# EAGLE design Hub (EAGLE 7.1.0)
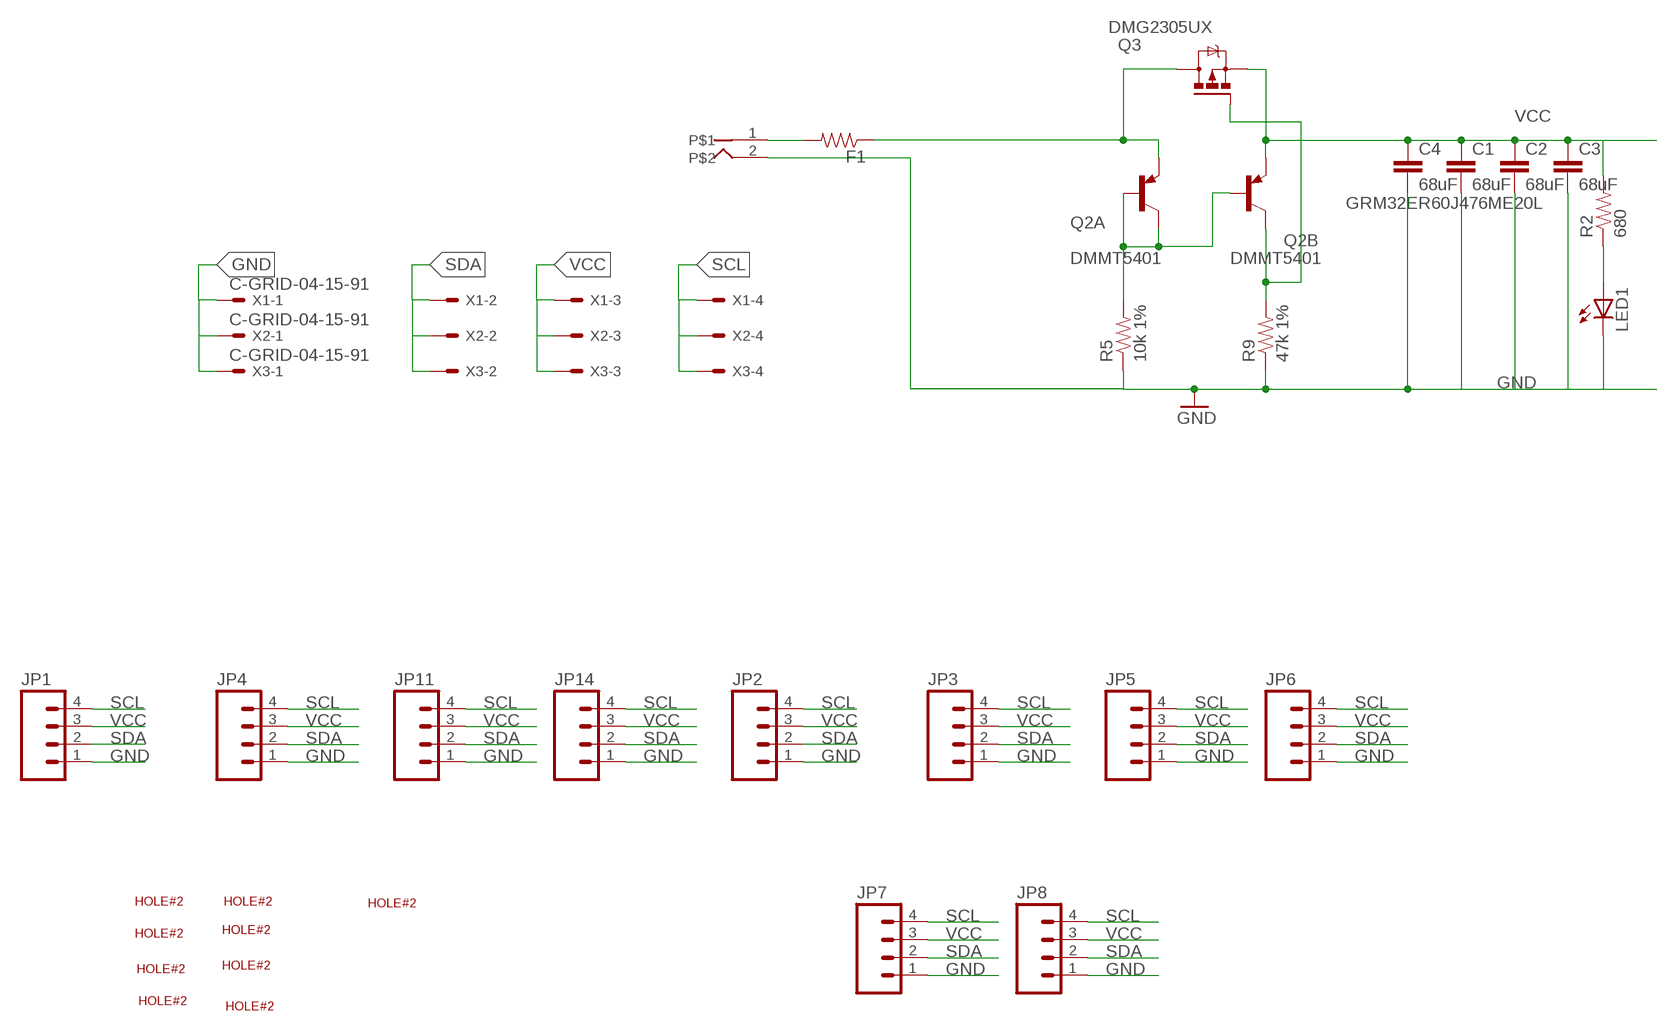
[diagram p0: schematic, sheet 1]

## Parts
C1  68uF  CAP1210  [1210]
C2  68uF  CAP1210  [1210]
C3  68uF  CAP1210  [1210]
C4  68uF  CAP1210  [1210]
F1  RESISTOR0805-RES  [0805]
JP1  M04LOCK  [1X04_LOCK]
JP2  M04LOCK  [1X04_LOCK]
JP3  M04LOCK  [1X04_LOCK]
JP4  M04LOCK  [1X04_LOCK]
JP5  M04LOCK  [1X04_LOCK]
JP6  M04LOCK  [1X04_LOCK]
JP7  M04LOCK  [1X04_LOCK]
JP8  M04LOCK  [1X04_LOCK]
JP11  M04LOCK  [1X04_LOCK]
JP14  M04LOCK  [1X04_LOCK]
LED1  LEDCHIP-LED0805  [CHIP-LED0805]
Q2  DMMT5401  TRANSISTOR-DUAL-PNP  [SOT-26]
Q3  DMG2305UX  IRLML5203  [MICRO3]
R2  680  RESISTOR0805-RES  [0805]
R5  10k 1%  RESISTOR0805-RES  [0805]
R9  47k 1%  RESISTOR0805-RES  [0805]
U$1  DC-JACKLOWPRO  [DC-POWER-JACK-LOWPRO]
U$6  HOLE#2  [HOLE-#2]
U$7  HOLE#2  [HOLE-#2]
U$8  HOLE#2  [HOLE-#2]
U$9  HOLE#2  [HOLE-#2]
U$10  HOLE#2  [HOLE-#2]
U$11  HOLE#2  [HOLE-#2]
U$12  HOLE#2  [HOLE-#2]
U$13  HOLE#2  [HOLE-#2]
U$14  HOLE#2  [HOLE-#2]
X1  C-GRID-04-15-91  [15-91-04]
X2  C-GRID-04-15-91  [15-91-04]
X3  C-GRID-04-15-91  [15-91-04]

## Nets
GND: C1.2 C2.2 C3.2 C4.2 JP1.1 JP2.1 JP3.1 JP4.1 JP5.1 JP6.1 JP7.1 JP8.1 JP11.1 JP14.1 LED1.C R5.1 R9.1 U$1.2 X1.1 X2.1 X3.1
N$1: F1.2 U$1.1
N$8: LED1.A R2.1
N$14: Q2.1(A:C) Q2.2(A:B) Q2.3(B:B) R5.2
N$16: Q2.4(B:C) Q3.1(G) R9.2
SCL: JP1.4 JP2.4 JP3.4 JP4.4 JP5.4 JP6.4 JP7.4 JP8.4 JP11.4 JP14.4 X1.4 X2.4 X3.4
SDA: JP1.2 JP2.2 JP3.2 JP4.2 JP5.2 JP6.2 JP7.2 JP8.2 JP11.2 JP14.2 X1.2 X2.2 X3.2
VCC: C1.1 C2.1 C3.1 C4.1 JP1.3 JP2.3 JP3.3 JP4.3 JP5.3 JP6.3 JP7.3 JP8.3 JP11.3 JP14.3 Q2.5(B:E) Q3.2(S) R2.2 X1.3 X2.3 X3.3
VREG: F1.1 Q2.6(A:E) Q3.3(D)
Unconnected: U$6.P$1(HOLE) U$7.P$1(HOLE) U$8.P$1(HOLE) U$9.P$1(HOLE) U$10.P$1(HOLE) U$11.P$1(HOLE) U$12.P$1(HOLE) U$13.P$1(HOLE) U$14.P$1(HOLE)

## Notes on the sheet
- GRM32ER60J476ME20L

## Library data of the parts
C1-C4 = SparkFun-Capacitors:CAP: Capacitor Standard 0603 ceramic capacitor, and 0.1" leaded capacitor.
F1 R2 R5 R9 = SparkFun-Passives:RESISTOR: Resistor Basic schematic elements and footprints for 0603, 1206, and PTH resistors.
JP1-JP8 JP11 JP14 = SparkFun-Connectors:M04: Header 4 Standard 4-pin 0.1" header. Use with straight break away headers (SKU : PRT-00116), right angle break away headers (PRT-00553), swiss pins (PRT-00743), machine pins (PRT-00117), and female headers (PRT-00115). Molex polarized connector foot print use with SKU : PRT-08231 with associated crimp pins and housings. 1MM SMD Version SKU: PRT-10208
LED1 = adafruit:LED: LED OSRAM: - CHIPLED LG R971, LG N971, LY N971, LG Q971, LY Q971, LO R971, LY R971 LH N974, LH R974 LS Q976, LO Q976, LY Q976 LO Q996 - Hyper CHIPLED LW Q18S LB Q993, LB Q99A, LB R99A - SideLED LS A670, LO A670, LY A670, LG A670, LP A670 LB A673, LV A673, LT A673, LW A673 LH A674 LY A675 LS A676, LA A676, LO A676, LY A676, LW A676 LS A679, LY A679, LG A679 - Hyper Micro SIDELED® LS Y876, LA Y876, LO Y876, LY Y876 LT Y87S - SmartLED LW L88C, LW L88S LB L89C, LB L89S, LG L890 LS L89K, LO L89K, LY L89K LS L896, LA L896, LO L896, LY L896 - TOPLED LS T670, LO T670, LY T670, LG T670, LP T670 LSG T670, LSP T670, LSY T670, LOP T670, LYG T670 LG T671, LOG T671, LSG T671 LB T673, LV T673, LT T673, LW T673 LH T674 LS T676, LA T676, LO T676, LY T676, LB T676, LH T676, LSB T676, LW T676 LB T67C, LV T67C, LT T67C, LS T67K, LO T67K, LY T67K, LW E67C LS E67B, LA E67B, LO E67B, LY E67B, LB E67C, LV E67C, LT E67C LW T67C LS T679, LY T679, LG T679 LS T770, LO T770, LY T770, LG T770, LP T770 LB T773, LV T773, LT T773, LW T773 LH T774 LS E675, LA E675, LY E675, LS T675 LS T776, LA T776, LO T776, LY T776, LB T776 LHGB T686 LT T68C, LB T68C - Hyper Mini TOPLED® LB M676 - Mini TOPLED Santana® LG M470 LS M47K, LO M47K, LY M47K Source: http://www.osram.convergy.de/
Q2 = IntegerLabs:TRANSISTOR-DUAL-PNP: PNP Transistor
Q3 = transistor-power:IRLML5203: HEXFET P-Channel Power MOSFET
U$1 = IntegerLabs:DC-JACK
U$6-U$14 = IntegerLabs:HOLE
X1-X3 = con-molex:C-GRID-04: CONNECTOR wire to board 2.54 mm (0.100") pitch header; OC_FARNELL: unknown; OC_NEWARK: unknown

## Board
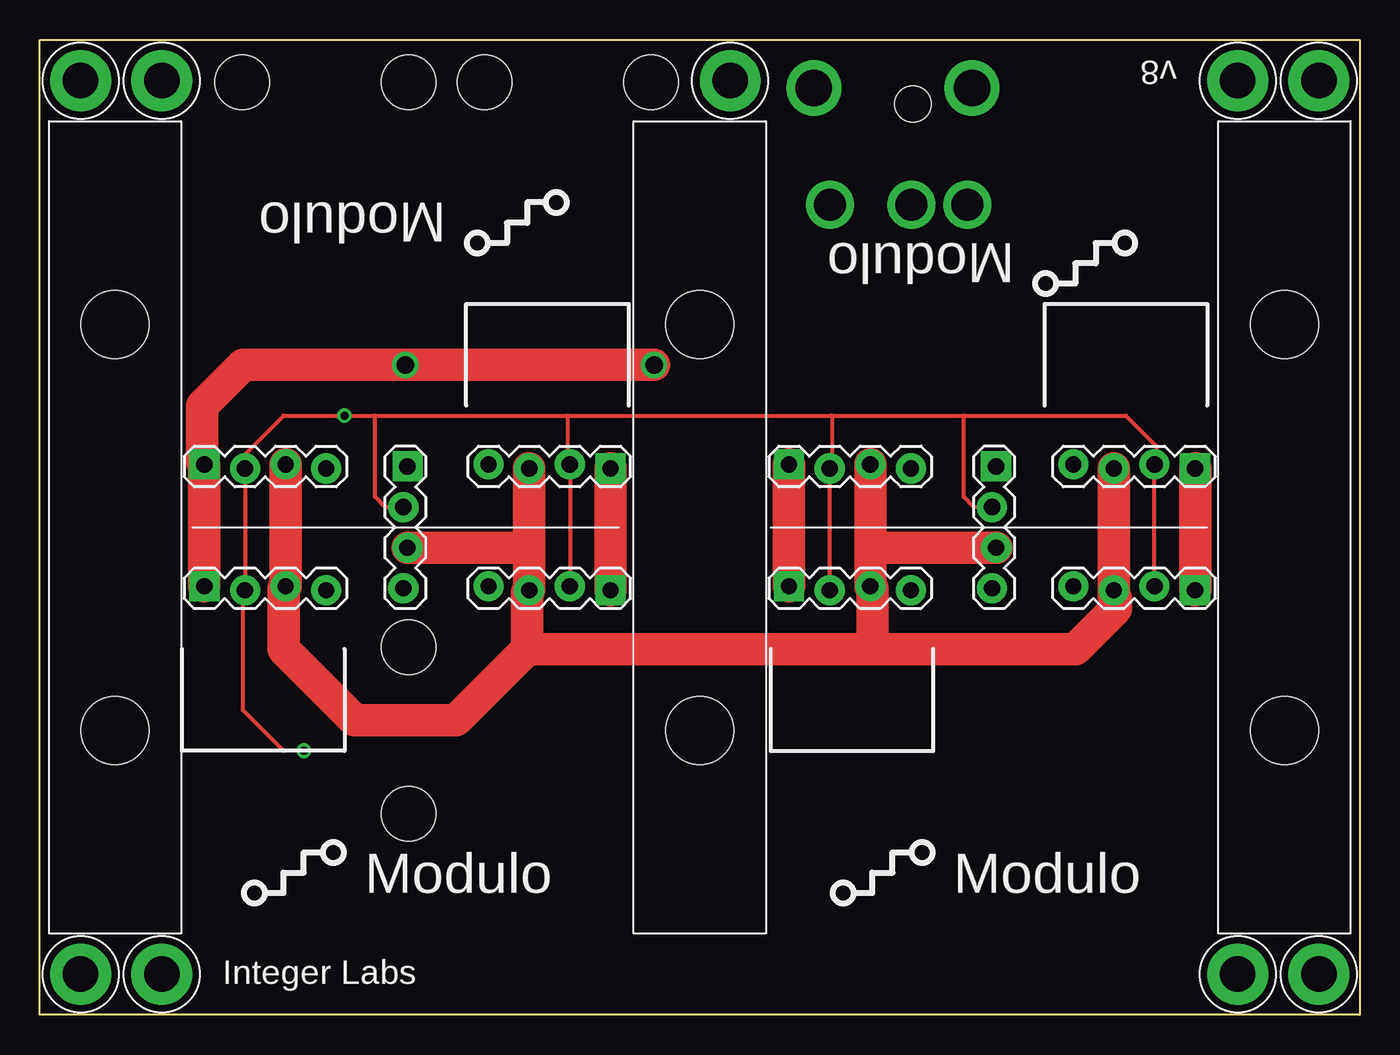
[diagram p1: board, top side]
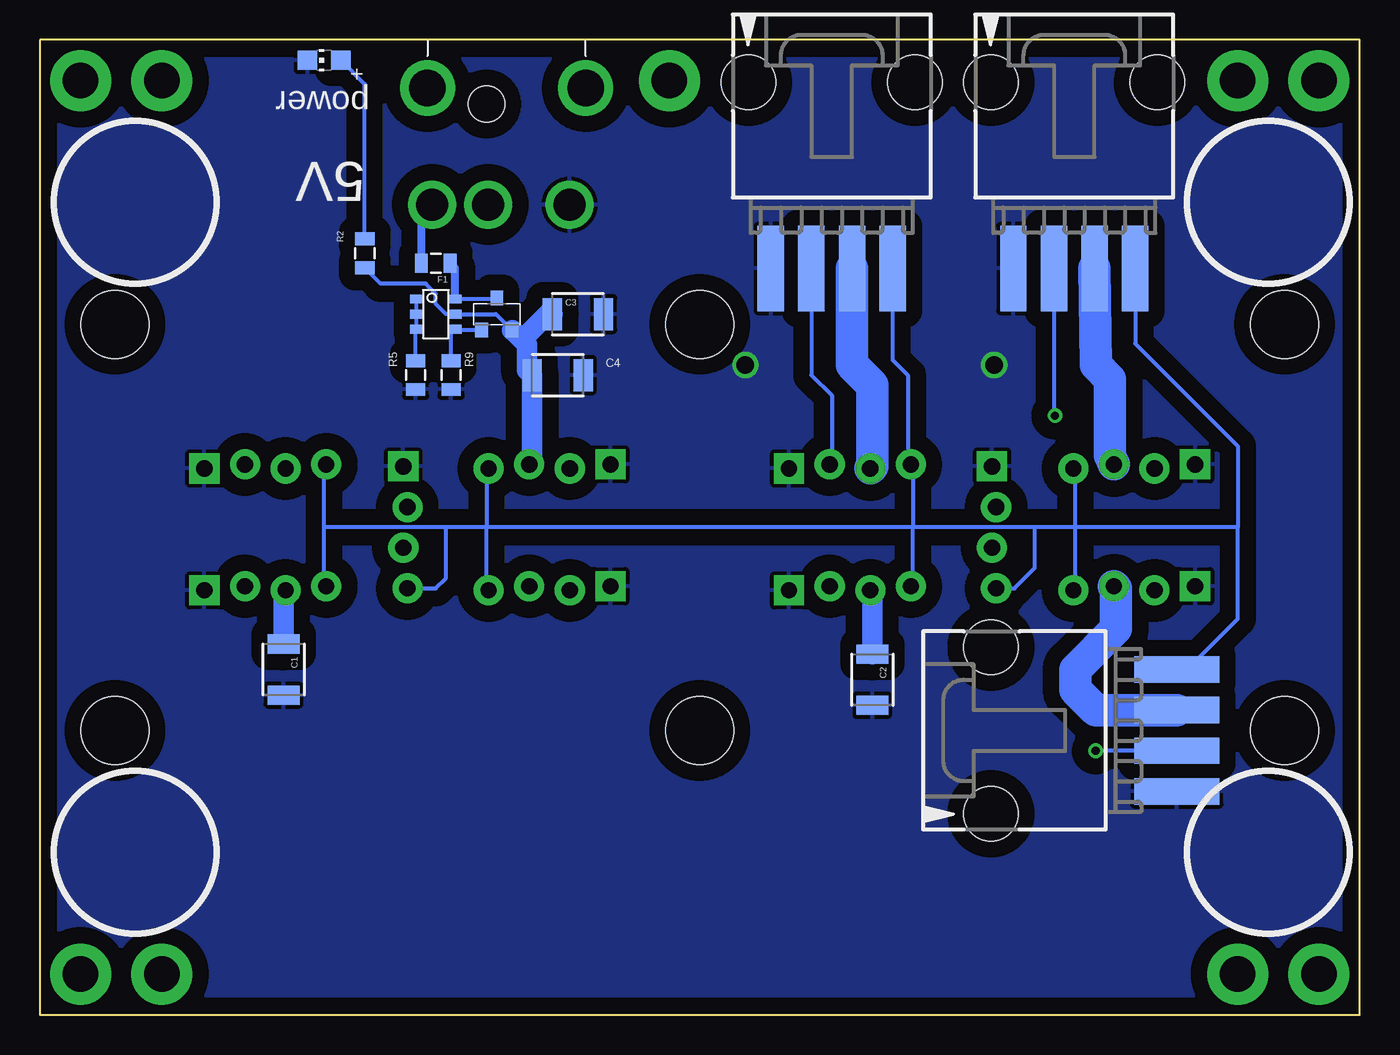
[diagram p2: board, bottom side, seen from below]

Size 82.55 x 60.96 mm. Coordinates in mm from the lower left corner, seen from the top.
Outline: 0,0 0,60.96 82.55,60.96 82.55,0 0,0
Copper layers (1*16): Top 0.0178mm / dielectric 59mil / Bottom 0.0178mm
Design rules "SSC-EAGLE-2Lyr_v1.0.0.3 *": minimum track width 6mil, minimum drill 14mil, track to track 6mil, track to pad 6mil, pad to pad 6mil, via to via 6mil, smd to smd 6mil, copper to edge 20mil, drill to drill 16mil, minimum pad ring 8mil, minimum via ring 8mil, stop-mask expansion 3mil, vias tented up to drill 25mil, thermal gap 10mil

### Footprints (pad centres in the part's own frame; a part is rotated, then mirrored left to right if it is on the bottom)
1210 = smd 1.2 x 2: 1 -1.6,0; 2 1.6,0
0805 = smd 0.8 x 1.2: 1 -0.9,0; 2 0.9,0
1X04_LOCK = drill 1.016 pad 1.88 square: 1 0,0.127 | drill 1.016 pad 1.88: 2 2.54,-0.127; 3 5.08,0.127; 4 7.62,-0.127
CHIP-LED0805 = smd 1.2 x 1.2: A 0,-1.05; C 0,1.05
SOT-26 = smd 0.55 x 0.8: 1 -0.95,-1.2; 2 0,-1.2; 3 0.95,-1.2; 4 0.95,1.2; 5 0,1.2; 6 -0.95,1.2
MICRO3 = smd 0.8 x 0.9: 1 -0.95,-1; 2 0.95,-1; 3 0,1
DC-POWER-JACK-LOWPRO = drill 2: 1 10.3,-3.4; 2 10.3,5.2; 3 10.3,0.1 | drill 2.3: S1 3,6.2; S2 3,-3.7 | hole 2.26: 4,0
CARD-GUIDE-2" = hole 4.242: 0,12.7; 0,-12.7
HOLE-#2 = drill 2.223 pad 3.81: P$1 0,0
15-91-04 = smd 1.651 x 5.334: 1 -3.81,-10.795; 2 -1.27,-10.795; 3 1.27,-10.795; 4 3.81,-10.795 | hole 3.404: -5.207,0.838; 5.207,0.838

### Placement (x,y rotation side)
C1  67.31,21.59 270 bottom
C2  30.48,20.95 270 bottom
C3  48.9,43.81 0 bottom
C4  50.16,40.01 0 bottom
F1  57.78,46.99 180 bottom
JP1  10.29,26.67 0 top
JP2  10.29,34.29 0 top
JP3  46.86,34.29 0 top
JP4  35.69,34.29 180 top
JP5  72.26,26.67 180 top
JP6  35.69,26.67 180 top
JP7  22.86,34.29 270 top
JP8  59.69,34.29 270 top
JP11  46.86,26.67 0 top
JP14  72.26,34.29 180 top
LED1  64.77,59.69 90 bottom
Q2  57.78,43.81 270 bottom
Q3  53.98,43.81 0 bottom
R2  62.23,47.62 270 bottom
R5  59.05,40.01 90 bottom
R9  56.83,40.01 90 bottom
U$1  54.61,60.96 270 bottom
U$3  [CARD-GUIDE-2"]  4.7,30.48 0 top
U$4  [CARD-GUIDE-2"]  41.27,30.48 0 top
U$5  [CARD-GUIDE-2"]  77.85,30.48 0 top
U$6  43.18,58.42 0 top
U$7  2.54,2.54 0 top
U$8  74.93,58.42 0 top
U$9  74.93,2.54 0 top
U$10  7.62,2.54 0 top
U$11  2.54,58.42 0 top
U$12  80.01,58.42 0 top
U$13  7.62,58.42 0 top
U$14  80.01,2.54 0 top
X1  33.02,57.47 0 bottom
X2  17.84,57.47 0 bottom
X3  22.23,17.78 90 bottom

### Tracks (layer width: path | path; a pad name or v marks a point on that pad's centre or on a via)
GND  (via drill 1.1)
  Top 2.032: JP1.1 JP2.1 10.16,34.54 10.16,38.1 12.7,40.64 v22.86,40.64 v38.42,40.64 | JP4.1 JP6.1 | JP3.1 JP11.1 | JP14.1 JP5.1
  pour Bottom (isolate 1.016): 0,0 0,60.96 82.55,60.96 82.55,0
N$1
  Bottom 0.508: F1.2 58.69,49.98 U$1.1
N$8
  Bottom 0.254: R2.1 62.23,58.2 LED1.A
N$14
  Bottom 0.254: R5.2 59.05,42.8 Q2.3 Q2.2 Q2.1
N$16
  Bottom 0.254: Q3.1 56.53,42.81 Q2.4 56.83,42.62 R9.2
SCL
  Bottom 0.254: 17.78,30.48 20.32,30.48 | 20.32,30.48 27.94,30.48 | 27.94,30.48 54.61,30.48 | 54.61,30.48 57.15,30.48 | 57.15,30.48 64.77,30.48 | 64.77,30.48 64.77,34.54 JP14.4 | JP3.4 54.61,34.29 54.61,30.48 | 27.94,30.48 27.94,34.54 JP4.4 28.26,35.18 28.26,40.01 29.21,40.96 X1.4 | 17.78,30.48 17.78,34.04 JP2.4 | JP1.4 17.78,26.67 17.78,30.48 | JP5.4 64.64,27.18 64.77,27.3 64.77,30.48 | JP11.4 54.61,26.67 54.61,30.48 | JP6.4 28.07,27.18 27.94,27.3 27.94,30.48 | 7.62,30.48 17.78,30.48 | X2.4 14.03,41.97 7.62,35.56 7.62,30.48 | JP7.4 21.59,26.67 20.32,27.94 20.32,30.48 | JP8.4 57.78,26.67 57.15,27.3 57.15,30.48 | X3.4 10.79,21.59 7.62,24.77 7.62,30.48
SDA  (via drill 0.51)
  Top 0.254: 20.95,37.47 v19.05,37.47 15.24,37.47 12.83,35.05 JP2.2 JP1.2 12.7,26.42 12.7,19.05 15.24,16.51 v16.51,16.51 | 20.95,37.47 33.02,37.47 | 33.02,37.47 49.53,37.47 | 49.53,37.47 57.78,37.47 | 57.78,37.47 67.94,37.47 69.85,35.56 69.85,34.54 JP14.2 JP5.2 | JP6.2 JP4.2 33.02,34.54 33.02,37.47 | JP11.2 JP3.2 49.53,34.29 49.53,37.47 | JP8.2 58.42,31.75 57.78,32.38 57.78,37.47 | JP7.2 21.59,31.75 20.95,32.38 20.95,37.47
  Bottom 0.254: X2.2 19.11,38.04 v19.05,37.47 | X1.2 34.29,40.01 33.02,38.73 33.02,34.54 JP4.2 | X3.2 v16.51,16.51
VCC
  Top 2.032: 52.07,22.86 64.77,22.86 67.31,25.4 67.31,26.04 67.18,26.16 JP5.3 JP14.3 | 52.07,22.86 30.48,22.86 | 30.48,22.86 26.04,18.41 19.68,18.41 15.24,22.86 15.24,26.67 JP1.3 JP2.3 | JP3.3 51.94,29.21 | 51.94,29.21 JP11.3 52.07,26.67 52.07,22.86 | JP4.3 30.61,29.21 | 30.61,29.21 JP6.3 30.48,26.42 30.48,22.86 | JP7.3 30.61,29.21 | JP8.3 51.94,29.21
  Bottom 0.254: Q3.2 54.02,43.81 Q2.5 57.15,43.81 57.78,44.45 57.78,45.09 58.42,45.72 61.23,45.72 R2.2
  Bottom 1.27: JP3.3 51.77,34.59 C4.1 52.07,40.31 52.07,41.91 52.39,42.23 | Q3.2 52.98,42.81 52.39,42.23 | C1.1 67.31,26.42 JP5.3 | C3.1 50.8,43.81 52.39,42.23 | C2.1 30.48,26.42 JP6.3
  Bottom 2.032: X2.3 16.51,40.64 15.62,39.75 15.62,34.99 JP2.3 | X1.3 31.75,40.64 30.48,39.37 30.48,34.29 JP4.3 | X3.3 16.51,19.05 17.78,20.32 17.78,21.59 15.24,24.13 15.24,26.67 JP1.3
VREG
  Bottom 0.254: Q2.6 54.02,44.77 Q3.3
  Bottom 0.508: Q2.6 56.59,46.69 F1.1

### Text on the board
tPlace: v8 | Modulo | Modulo | Modulo | Modulo | Integer Labs
bPlace: power | 5V